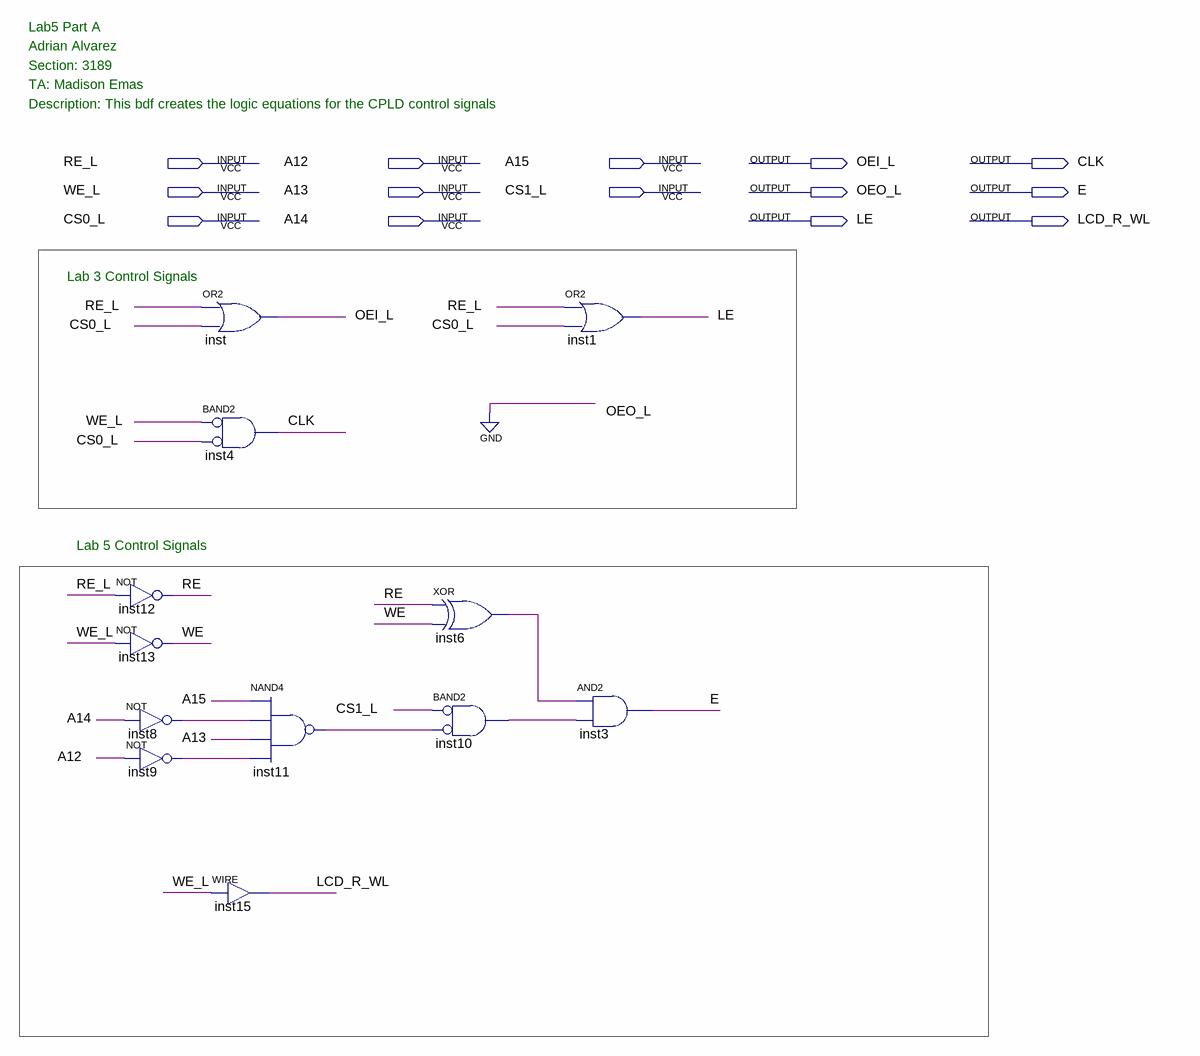
[diagram p0: schematic sheet]
// Quartus schematic Lab5.bdf as structural Verilog: 12 symbols, 14 pins
module Lab5 (
  input  RE_L,
  input  A12,
  input  A15,
  input  WE_L,
  input  A13,
  input  CS1_L,
  input  CS0_L,
  input  A14,
  output OEI_L,
  output CLK,
  output OEO_L,
  output E,
  output LE,
  output LCD_R_WL
);

  wire inst6_out, inst8_out, inst9_out, inst10_out, inst11_out, RE, WE;

  not inst12 (RE, RE_L);
  not inst13 (WE, WE_L);
  not inst8 (inst8_out, A14);
  not inst9 (inst9_out, A12);
  or inst (OEI_L, RE_L, CS0_L);
  and inst4 (CLK, ~WE_L, ~CS0_L);  // BAND2
  nand inst11 (inst11_out, A15, inst8_out, A13, inst9_out);
  assign LCD_R_WL = WE_L;  // WIRE inst15
  xor inst6 (inst6_out, RE, WE);
  and inst10 (inst10_out, ~CS1_L, ~inst11_out);  // BAND2
  or inst1 (LE, RE_L, CS0_L);
  and inst3 (E, inst6_out, inst10_out);

  assign OEO_L = 1'b0;

  // Notes on the sheet:
  //   Lab5 Part A
  //   Adrian Alvarez
  //   Section: 3189
  //   TA: Madison Emas
  //   Description: This bdf creates the logic equations for the CPLD control signals
  //   Lab 3 Control Signals
  //   Lab 5 Control Signals
endmodule
